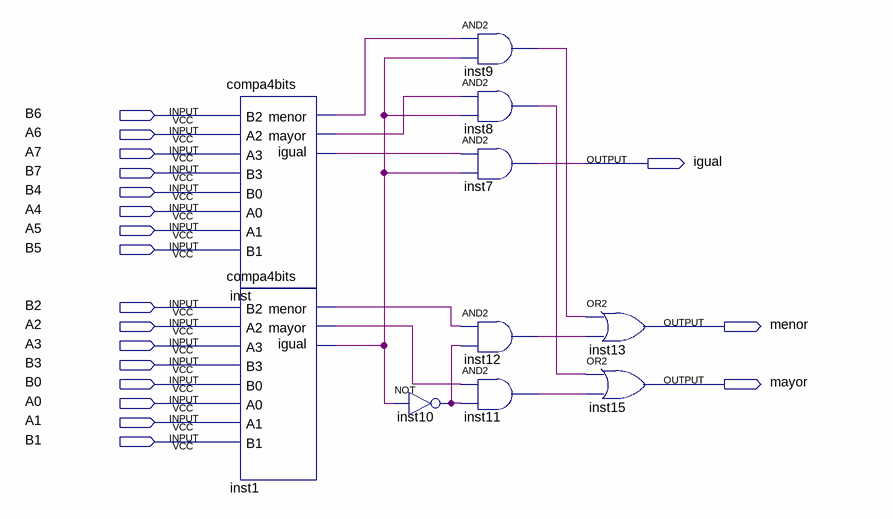
[diagram p0: schematic sheet]
// Quartus schematic compa8bits.bdf as structural Verilog: 10 symbols, 19 pins
module compa8bits (
  input  B6,
  input  A6,
  input  A7,
  input  B7,
  input  B4,
  input  A4,
  input  A5,
  input  B5,
  input  B2,
  input  A2,
  input  A3,
  input  B3,
  input  B0,
  input  A0,
  input  A1,
  input  B1,
  output igual,
  output menor,
  output mayor
);

  wire inst1_igual, inst1_mayor, inst1_menor, inst8_out, inst9_out, inst10_out, inst11_out, inst12_out,
       inst_igual, inst_mayor, inst_menor;

  compa4bits inst (
    .B2(B6), .A2(A6), .A3(A7), .B3(B7), .B0(B4), .A0(A4), .A1(A5), .B1(B5), .igual(inst_igual),
    .menor(inst_menor), .mayor(inst_mayor));
  compa4bits inst1 (
    .B2(B2), .A2(A2), .A3(A3), .B3(B3), .B0(B0), .A0(A0), .A1(A1), .B1(B1), .igual(inst1_igual),
    .menor(inst1_menor), .mayor(inst1_mayor));
  not inst10 (inst10_out, inst1_igual);
  and inst9 (inst9_out, inst_menor, inst1_igual);
  and inst8 (inst8_out, inst_mayor, inst1_igual);
  and inst7 (igual, inst_igual, inst1_igual);
  and inst12 (inst12_out, inst1_menor, inst10_out);
  and inst11 (inst11_out, inst1_mayor, inst10_out);
  or inst13 (menor, inst9_out, inst12_out);
  or inst15 (mayor, inst8_out, inst11_out);
endmodule
